# EAGLE design AC-4ch-01 (EAGLE 7.6.0)
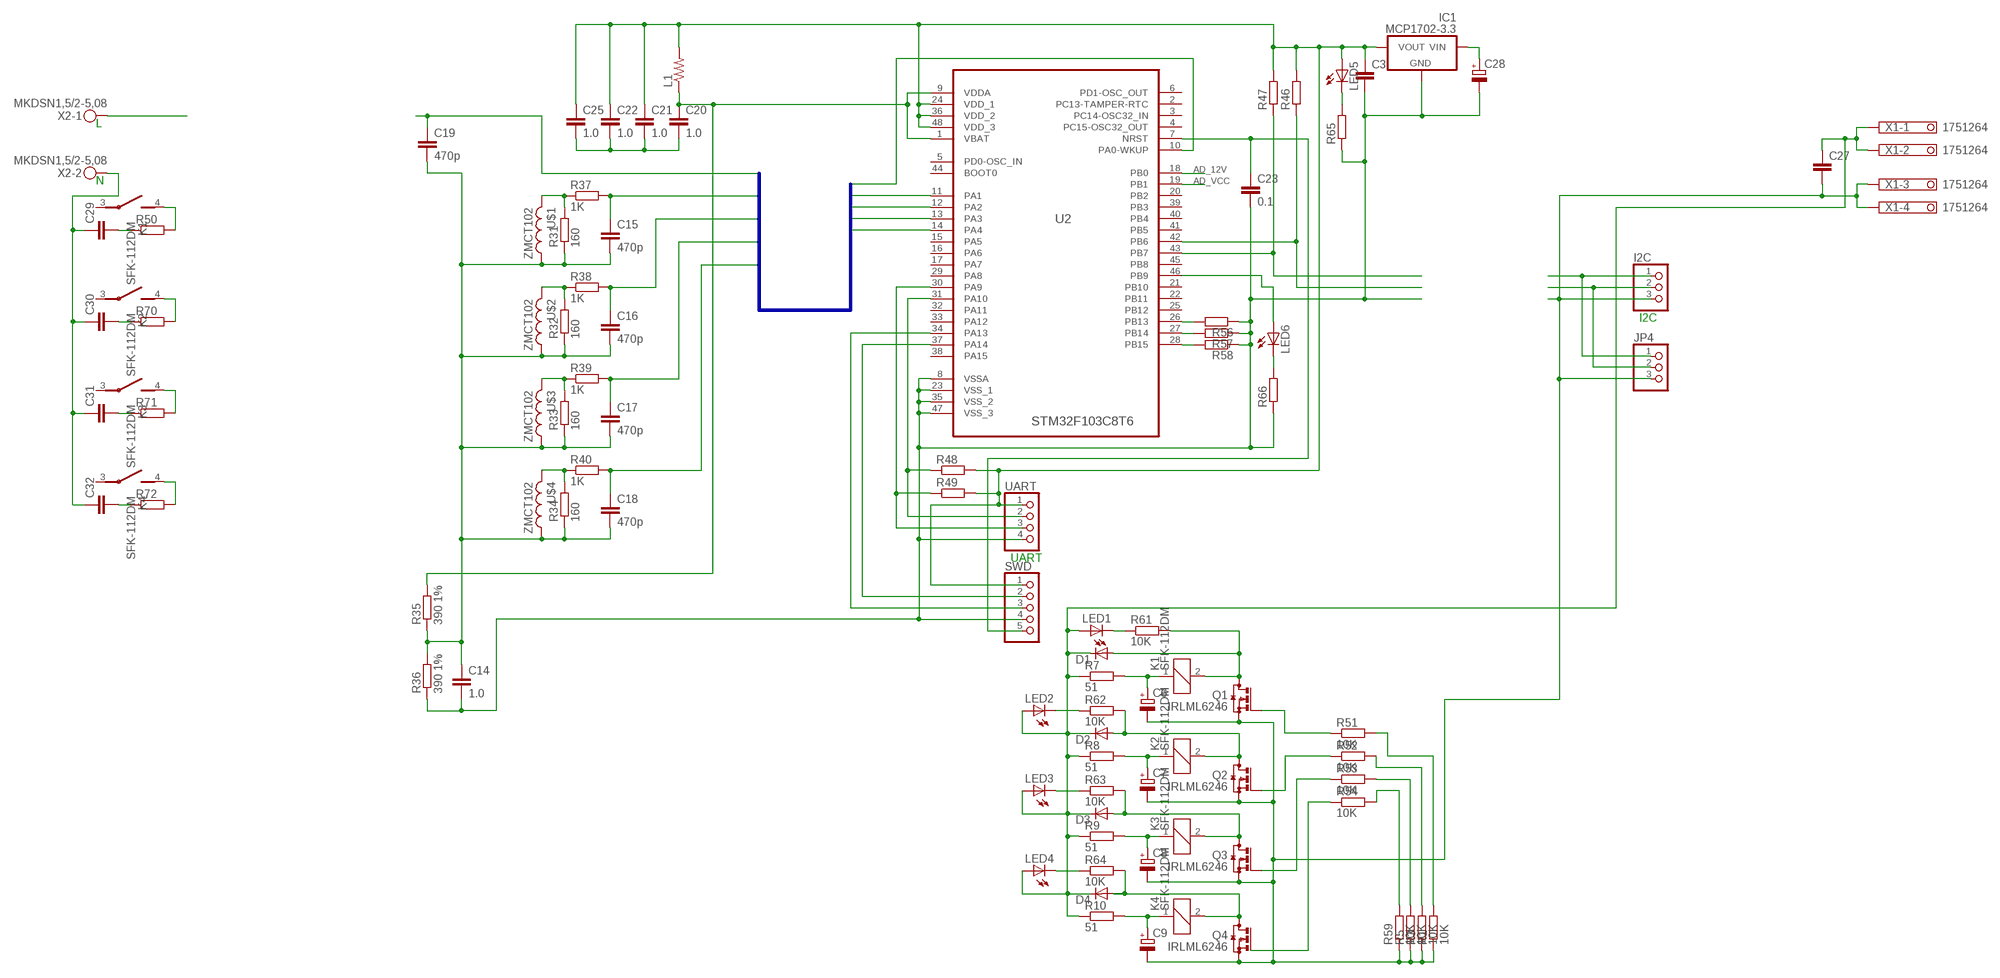
[diagram p0: schematic, sheet 1]

## Parts
C3  C-EUC0805  [C0805]
C6  CPOL-EUE3.5-8  [E3,5-8]
C7  CPOL-EUE3.5-8  [E3,5-8]
C8  CPOL-EUE3.5-8  [E3,5-8]
C9  CPOL-EUE3.5-8  [E3,5-8]
C14  1.0  C-EUC0805  [C0805]
C15  470p  C-EUC0603  [C0603]
C16  470p  C-EUC0603  [C0603]
C17  470p  C-EUC0603  [C0603]
C18  470p  C-EUC0603  [C0603]
C19  470p  C-EUC0603  [C0603]
C20  1.0  C-EUC0805  [C0805]
C21  1.0  C-EUC0805  [C0805]
C22  1.0  C-EUC0805  [C0805]
C23  0.1  C-EUC0603  [C0603]
C25  1.0  C-EUC0805  [C0805]
C27  C-EUC1206  [C1206]
C28  CPOL-EUSMCB  [SMC_B]
C29  C-EU225-087X268  [C225-087X268]
C30  C-EU225-087X268  [C225-087X268]
C31  C-EU225-087X268  [C225-087X268]
C32  C-EU225-087X268  [C225-087X268]
D1  DIODE-SOD123  [SOD123]
D2  DIODE-SOD123  [SOD123]
D3  DIODE-SOD123  [SOD123]
D4  DIODE-SOD123  [SOD123]
I2C  PINHD-1X3  [1X03]
IC1  MCP1702-3.3  MCP1702SOT23  [SOT23-3-ROTATED]
JP4  PINHD-1X3  [1X03]
K1  SFK-112DM  [SFK112]
K2  SFK-112DM  [SFK112]
K3  SFK-112DM  [SFK112]
K4  SFK-112DM  [SFK112]
L1  R-US_M0805  [M0805]
LED1  LEDCHIP-LED0805  [CHIP-LED0805]
LED2  LEDCHIP-LED0805  [CHIP-LED0805]
LED3  LEDCHIP-LED0805  [CHIP-LED0805]
LED4  LEDCHIP-LED0805  [CHIP-LED0805]
LED5  LEDCHIP-LED0805  [CHIP-LED0805]
LED6  LEDCHIP-LED0805  [CHIP-LED0805]
Q1  IRLML6246  BSS123  [SOT23]
Q2  IRLML6246  BSS123  [SOT23]
Q3  IRLML6246  BSS123  [SOT23]
Q4  IRLML6246  BSS123  [SOT23]
R1  10K  R-EU_R0603  [R0603]
R3  10K  R-EU_R0603  [R0603]
R5  10K  R-EU_R0603  [R0603]
R7  51  R-EU_R1206  [R1206]
R8  51  R-EU_R1206  [R1206]
R9  51  R-EU_R1206  [R1206]
R10  51  R-EU_R1206  [R1206]
R31  160  R-EU_R0603  [R0603]
R32  160  R-EU_R0603  [R0603]
R33  160  R-EU_R0603  [R0603]
R34  160  R-EU_R0603  [R0603]
R35  390 1%  R-EU_R0603  [R0603]
R36  390 1%  R-EU_R0603  [R0603]
R37  1K  R-EU_R0603  [R0603]
R38  1K  R-EU_R0603  [R0603]
R39  1K  R-EU_R0603  [R0603]
R40  1K  R-EU_R0603  [R0603]
R46  R-EU_R0603  [R0603]
R47  R-EU_R0603  [R0603]
R48  R-EU_R0603  [R0603]
R49  R-EU_R0603  [R0603]
R50  R-EU_0414/5V  [0414V]
R51  10K  R-EU_R0603  [R0603]
R52  10K  R-EU_R0603  [R0603]
R53  10K  R-EU_R0603  [R0603]
R54  10K  R-EU_R0603  [R0603]
R56  R-EU_R0603  [R0603]
R57  R-EU_R0603  [R0603]
R58  R-EU_R0603  [R0603]
R59  10K  R-EU_R0603  [R0603]
R61  10K  R-EU_R0603  [R0603]
R62  10K  R-EU_R0603  [R0603]
R63  10K  R-EU_R0603  [R0603]
R64  10K  R-EU_R0603  [R0603]
R65  R-EU_R0603  [R0603]
R66  R-EU_R0603  [R0603]
R70  R-EU_0414/5V  [0414V]
R71  R-EU_0414/5V  [0414V]
R72  R-EU_0414/5V  [0414V]
SWD  PINHD-1X5  [1X05]
U2  STM32F103C8T6  STM32F100CBT6B  [QFP50P900X900X160-48N]
U$1  ZMCT102  [ZMCT]
U$2  ZMCT102  [ZMCT]
U$3  ZMCT102  [ZMCT]
U$4  ZMCT102  [ZMCT]
UART  PINHD-1X4  [1X04]
X1  1751264  [1751264]
X2  MKDSN1,5/2-5,08  [MKDSN1,5/2-5,08]

## Nets
0V: C3.2 C14.2 C20.2 C21.2 C22.2 C23.2 C25.2 C28.- IC1.1(GND) R36.1 R56.1 R57.1 R58.1 R65.1 R66.1 SWD.4 U2.8(VSSA) U2.23(VSS_1) U2.35(VSS_2) U2.47(VSS_3) UART.4
3.3V: C3.1 C21.1 C22.1 C25.1 IC1.2(VOUT) L1.2 LED5.A R46.2 R47.2 R48.2 R49.2 SWD.1 U2.24(VDD_1) U2.36(VDD_2) U2.48(VDD_3) UART.1
+12V: C27.1 D1.C D2.C D3.C D4.C LED1.A LED2.A LED3.A LED4.A R7.1 R8.1 R9.1 R10.1 X1.1 X1.2
A0: C18.1 R40.2 U2.10(PA0-WKUP)
A1: C17.1 R39.2 U2.11(PA1)
A2: C16.1 R38.2 U2.12(PA2)
A3: C15.1 R37.2 U2.13(PA3)
A4: C19.1 U2.14(PA4)
A9: C14.1 C15.2 C16.2 C17.2 C18.2 C19.2 R31.1 R32.1 R33.1 R34.1 R35.1 R36.2 U$1.1 U$2.1 U$3.1 U$4.1
AD_12V: U2.18(PB0)
AD_VCC: U2.19(PB1)
GND: C6.- C7.- C8.- C9.- C27.2 I2C.3 JP4.3 Q1.2(S) Q2.2(S) Q3.2(S) Q4.2(S) R1.1 R3.1 R5.1 R59.1 X1.3 X1.4
I2C: I2C.2 JP4.2
N$1: C29.1 C30.1 C31.1 C32.1 X2.2
N$2: C29.2 R50.1
N$4: R31.2 R37.1 U$1.2
N$5: R32.2 R38.1 U$2.2
N$6: R56.2 U2.26(PB13)
N$7: C30.2 R70.1
N$8: C31.2 R71.1
N$12: LED1.C R61.1
N$13: R47.1 U2.43(PB7)
N$14: R33.2 R39.1 U$3.2
N$15: R46.1 U2.42(PB6)
N$16: R34.2 R40.1 U$4.2
N$17: LED2.C R62.1
N$18: C32.2 R72.1
N$19: LED3.C R63.1
N$20: LED4.C R64.1
N$21: LED5.C R65.2
N$22: LED6.C R66.2
N$23: LED6.A U2.46(PB9)
N$26: R57.2 U2.27(PB14)
N$28: R5.2 R53.2
N$31: C23.1 SWD.5 U2.7(NRST)
N$32: R3.2 R52.2
N$33: R1.2 R51.2
N$34: R54.2 R59.2
N$36: R58.2 U2.28(PB15)
N$37: X2.1
N$38: Q1.1(G) R51.1
N$39: Q2.1(G) R52.1
N$40: Q3.1(G) R53.1
N$41: Q4.1(G) R54.1
N$42: C28.+ IC1.3(VIN)
N$44: D2.A K2.2 Q2.3(D) R62.2
N$45: C7.+ K2.1 R8.2
N$46: C8.+ K3.1 R9.2
N$47: D3.A K3.2 Q3.3(D) R63.2
N$48: C9.+ K4.1 R10.2
N$49: D4.A K4.2 Q4.3(D) R64.2
N$50: D1.A K1.2 Q1.3(D) R61.2
N$51: C6.+ K1.1 R7.2
N$74: K1.4(K:S) R50.2
N$75: K2.4(K:S) R70.2
N$76: K3.4(K:S) R71.2
N$77: K4.4(K:S) R72.2
N$80: C20.1 L1.1 R35.2 U2.1(VBAT) U2.9(VDDA)
RX: R48.1 U2.31(PA10) UART.2
SDA: I2C.1 JP4.1
SWCLK: SWD.2 U2.37(PA14)
SWDIO: SWD.3 U2.34(PA13)
TX: R49.1 U2.30(PA9) UART.3
Unconnected: K1.3(K:P) K2.3(K:P) K3.3(K:P) K4.3(K:P) U2.2(PC13-TAMPER-RTC) U2.3(PC14-OSC32_IN) U2.4(PC15-OSC32_OUT) U2.5(PD0-OSC_IN) U2.6(PD1-OSC_OUT) U2.15(PA5) U2.16(PA6) U2.17(PA7) U2.20(PB2) U2.21(PB10) U2.22(PB11) U2.25(PB12) U2.29(PA8) U2.32(PA11) U2.33(PA12) U2.38(PA15) U2.39(PB3) U2.40(PB4) U2.41(PB5) U2.44(BOOT0) U2.45(PB8)

## Buses
B$1

## Notes on the sheet
- L
- N
- I2C
- UART

## Library data of the parts
C3 C14-C23 C25 C27 C29-C32 = rcl:C-EU: CAPACITOR, European symbol
C6-C9 C28 = rcl:CPOL-EU: POLARIZED CAPACITOR, European symbol
D1-D4 = diode:DIODE-: DIODE
I2C JP4 = pinhead:PINHD-1X3: PIN HEADER
IC1 = SteveMarple:MCP1702: Microchip MCP1702 250mA low quiescent current (2uA) LDO voltage regulator.
K1-K4 = custom:SFK-112DM
L1 = rcl:R-US_: RESISTOR, American symbol
LED1-LED6 = led:LED: LED OSRAM: - CHIPLED LG R971, LG N971, LY N971, LG Q971, LY Q971, LO R971, LY R971 LH N974, LH R974 LS Q976, LO Q976, LY Q976 LO Q996 - Hyper CHIPLED LW Q18S LB Q993, LB Q99A, LB R99A - SideLED LS A670, LO A670, LY A670, LG A670, LP A670 LB A673, LV A673, LT A673, LW A673 LH A674 LY A675 LS A676, LA A676, LO A676, LY A676, LW A676 LS A679, LY A679, LG A679 - Hyper Micro SIDELED® LS Y876, LA Y876, LO Y876, LY Y876 LT Y87S - SmartLED LW L88C, LW L88S LB L89C, LB L89S, LG L890 LS L89K, LO L89K, LY L89K LS L896, LA L896, LO L896, LY L896 - TOPLED LS T670, LO T670, LY T670, LG T670, LP T670 LSG T670, LSP T670, LSY T670, LOP T670, LYG T670 LG T671, LOG T671, LSG T671 LB T673, LV T673, LT T673, LW T673 LH T674 LS T676, LA T676, LO T676, LY T676, LB T676, LH T676, LSB T676, LW T676 LB T67C, LV T67C, LT T67C, LS T67K, LO T67K, LY T67K, LW E67C LS E67B, LA E67B, LO E67B, LY E67B, LB E67C, LV E67C, LT E67C LW T67C LS T679, LY T679, LG T679 LS T770, LO T770, LY T770, LG T770, LP T770 LB T773, LV T773, LT T773, LW T773 LH T774 LS E675, LA E675, LY E675, LS T675 LS T776, LA T776, LO T776, LY T776, LB T776 LHGB T686 LT T68C, LB T68C - Hyper Mini TOPLED® LB M676 - Mini TOPLED Santana® LG M470 LS M47K, LO M47K, LY M47K Source: http://www.osram.convergy.de LUXEON: - LUMILED® LXK2-PW12-R00, LXK2-PW12-S00, LXK2-PW14-U00, LXK2-PW14-V00 LXK2-PM12-R00, LXK2-PM12-S00, LXK2-PM14-U00 LXK2-PE12-Q00, LXK2-PE12-R00, LXK2-PE12-S00, LXK2-PE14-T00, LXK2-PE14-U00 LXK2-PB12-K00, LXK2-PB12-L00, LXK2-PB12-M00, LXK2-PB14-N00, LXK2-PB14-P00, LXK2-PB14-Q00 LXK2-PR12-L00, LXK2-PR12-M00, LXK2-PR14-Q00, LXK2-PR14-R00 LXK2-PD12-Q00, LXK2-PD12-R00, LXK2-PD12-S00 LXK2-PH12-R00, LXK2-PH12-S00 LXK2-PL12-P00, LXK2-PL12-Q00, LXK2-PL12-R00 Source: www.luxeon.com KINGBRIGHT: KA-3528ASYC Source: www.kingbright.com
Q1-Q4 = transistor-small-signal:BSS123: N-CHANNEL MOS FET
R1 R3 R5 R7-R10 R31-R40 R46-R54 R56-R59 R61-R66 R70-R72 = rcl:R-EU_: RESISTOR, European symbol
SWD = pinhead:PINHD-1X5: PIN HEADER
U2 = ST Microelctronics_By_element14_Batch_1:STM32F100CBT6B: ARM-based 32-bit MCU; MPN: STM32F100CBT6B; OC_FARNELL: 1838512; OC_NEWARK: 86R1308; PACKAGE: LQFP-48; SUPPLIER: STMircroelectronics
U$1-U$4 = custom:ZMCT102
UART = pinhead:PINHD-1X4: PIN HEADER
X1 = con-phoenix-350:1751264: MKDS 1/ 4-3,5 Printklemme Nennstrom: 10 A Bemessungsspannung: 160 V Raster: 3,5 mm Polzahl: 4 Montageart: Löten Anschlussart: Schraubanschluss Anschlussrichtung vom Leiter zur Platine: 0° Source: http://eshop.phoenixcontact.com .. 1751264.pdf; MPN: 1751264; OC_FARNELL: unknown; OC_NEWARK: 10R0934
X2 = con-phoenix-508:MKDSN1,5/2-5,08: MKDSN 1,5/ 2-5,08 Printklemme Nennstrom: 13,5 A Nennspannung: 250 V Rastermaß: 5,08 mm Polzahl: 2 Anschlussart: Schraubanschluss Montage: Löten Anschlussrichtung Leiter/Platine: 0 ° Artikelnummer: 1729128 Source: http://eshop.phoenixcontact.com .. 1729128.pdf

## Board
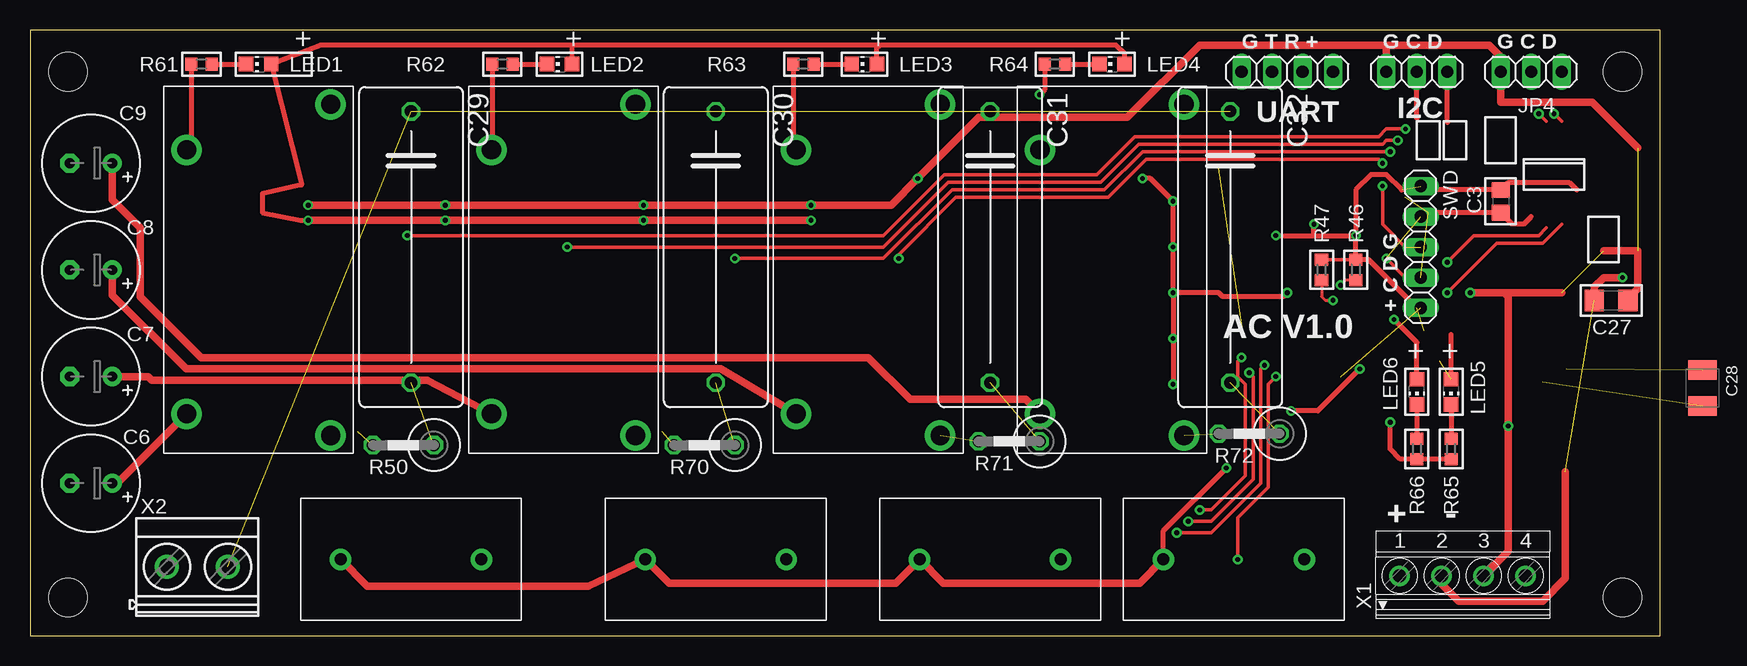
[diagram p1: board, top side]
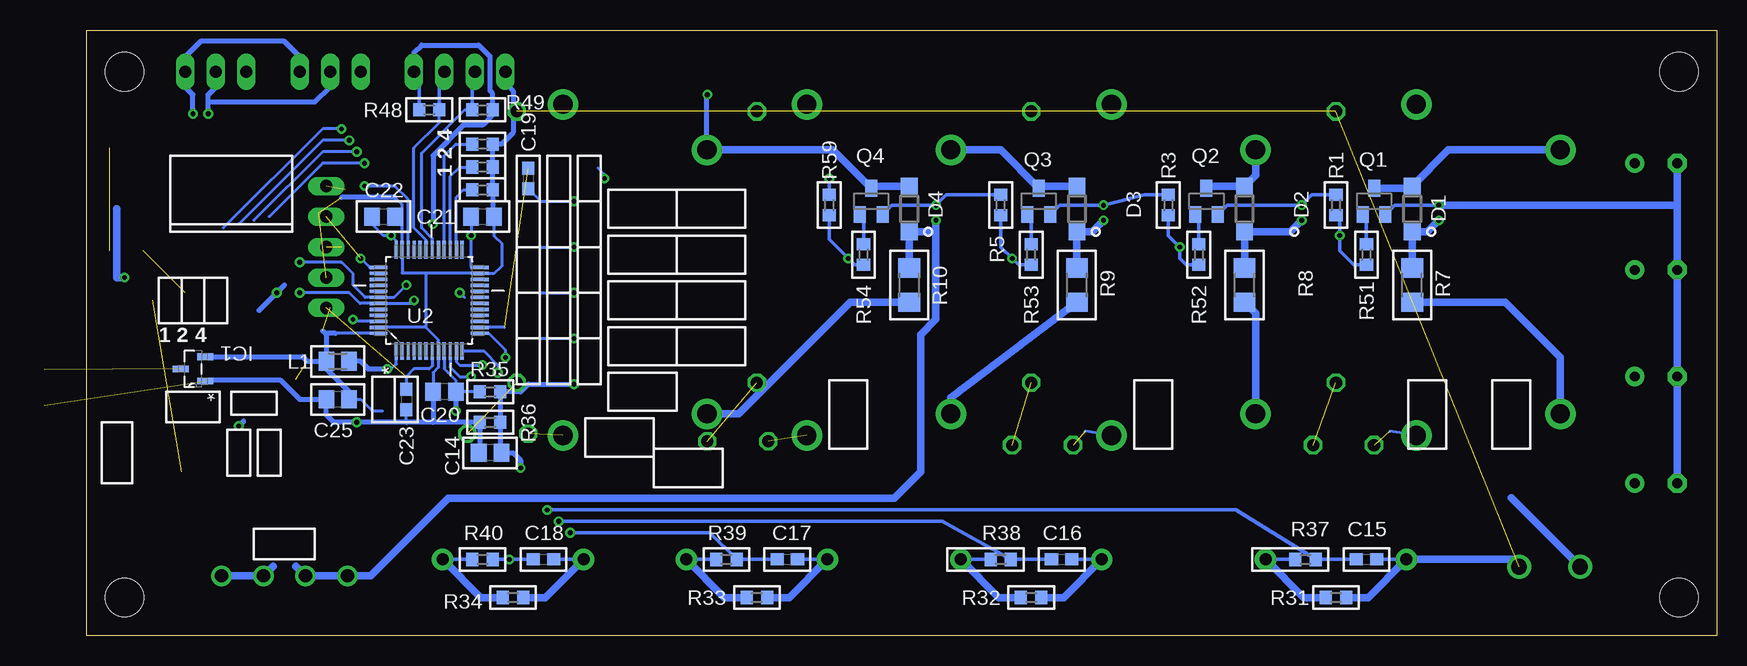
[diagram p2: board, bottom side, seen from below]

Size 135.87 x 50.47 mm. Coordinates in mm from the lower left corner, seen from the top.
Outline: 0,0 135.87,0 135.87,50.47 0,50.47 0,0
Copper layers (1*16): Top 0.035mm / dielectric 1.5mm / Bottom 0.035mm
Design rules "default *": minimum track width 8mil, minimum drill 0.35mm, track to track 6mil, track to pad 8mil, pad to pad 10mil, via to via 10mil, smd to smd 8mil, copper to edge 30mil, drill to drill 20mil, minimum pad ring 10mil, minimum via ring 8mil, stop-mask expansion 4mil, vias tented up to drill 20mil, thermal gap 10mil
Holes 3.2 mm at 132.72,46.99 3.17,46.99 3.17,3.17 132.72,3.17

### Footprints (pad centres in the part's own frame; a part is rotated, then mirrored left to right if it is on the bottom)
C0805 = smd 1.3 x 1.5: 1 -0.95,0; 2 0.95,0
E3,5-8 = drill 0.813 pad 1.6: + -1.778,0 | drill 0.813 pad 1.6 octagon: - 1.778,0
C0603 = smd 1.1 x 1: 1 -0.85,0; 2 0.85,0
C1206 = smd 1.6 x 1.8: 1 -1.4,0; 2 1.4,0
SMC_B = smd 1.6 x 2.4: + -1.5,0; - 1.5,0
C225-087X268 = drill 1.016 octagon: 1 -11.303,0; 2 11.303,0
SOD123 = smd 1.4 x 1.4: A 1.9,0; C -1.9,0
1X03 = drill 1.016 long: 1 -2.54,0; 2 0,0; 3 2.54,0
SOT23-3-ROTATED = smd 1.321 x 0.559: 1 -1.016,1.016; 2 -1.016,-1.016; 3 1.016,0
SFK112 = drill 1.6 pad 2.54: 1 -12,6; 2 10,6; 3 13.8,-6; 4 -13.8,-6
M0805 = smd 1.3 x 1.6: 1 -0.95,0; 2 0.95,0
CHIP-LED0805 = smd 1.2 x 1.2: A 0,-1.05; C 0,1.05
SOT23 = smd 1 x 1.4: 1 -0.95,-1.1; 2 0.95,-1.1; 3 0,1.1
R0603 = smd 1 x 1.1: 1 -0.85,0; 2 0.85,0
R1206 = smd 1.6 x 1.803: 1 -1.422,0; 2 1.422,0
0414V = drill 1.016 octagon: 1 -2.54,0; 2 2.54,0
1X05 = drill 1.016 long: 1 -5.08,0; 2 -2.54,0; 3 0,0; 4 2.54,0; 5 5.08,0
QFP50P900X900X160-48N = smd 1.473 x 0.279: 1 -4.216,2.743; 2 -4.216,2.261; 3 -4.216,1.753; 4 -4.216,1.245; 5 -4.216,0.762; 6 -4.216,0.254; 7 -4.216,-0.254; 8 -4.216,-0.762; 9 -4.216,-1.245; 10 -4.216,-1.753; 11 -4.216,-2.261; 12 -4.216,-2.743; 25 4.216,-2.743; 26 4.216,-2.261; 27 4.216,-1.753; 28 4.216,-1.245; 29 4.216,-0.762; 30 4.216,-0.254; 31 4.216,0.254; 32 4.216,0.762; 33 4.216,1.245; 34 4.216,1.753; 35 4.216,2.261; 36 4.216,2.743 | smd 0.279 x 1.473: 13 -2.743,-4.216; 14 -2.261,-4.216; 15 -1.753,-4.216; 16 -1.245,-4.216; 17 -0.762,-4.216; 18 -0.254,-4.216; 19 0.254,-4.216; 20 0.762,-4.216; 21 1.245,-4.216; 22 1.753,-4.216; 23 2.261,-4.216; 24 2.743,-4.216; 37 2.743,4.216; 38 2.261,4.216; 39 1.753,4.216; 40 1.245,4.216; 41 0.762,4.216; 42 0.254,4.216; 43 -0.254,4.216; 44 -0.762,4.216; 45 -1.245,4.216; 46 -1.753,4.216; 47 -2.261,4.216; 48 -2.743,4.216
ZMCT = drill 1 pad 1.778: 1 -5.874,0; 2 5.874,0
1X04 = drill 1.016 long: 1 -3.81,0; 2 -1.27,0; 3 1.27,0; 4 3.81,0
1751264 = drill 1.1 pad 1.7: 1 -5.25,-0.1; 2 -1.75,-0.1; 3 1.75,-0.1; 4 5.25,-0.1
MKDSN1,5/2-5,08 = drill 1.3 pad 2: 1 -2.561,0.025; 2 2.519,0.025

### Placement (x,y rotation side)
C3  122.55,36.2 270 top
C6  5.08,12.7 180 top
C7  5.08,21.59 180 top
C8  5.08,30.48 180 top
C9  5.08,39.37 180 top
C14  102.23,15.24 180 bottom
C15  29.21,6.35 0 bottom
C16  54.61,6.35 0 bottom
C17  77.47,6.35 0 bottom
C18  97.79,6.35 0 bottom
C19  99.06,38.1 270 bottom
C20  106.05,20.32 180 bottom
C21  102.87,34.92 0 bottom
C22  111.12,34.92 0 bottom
C23  109.22,19.68 270 bottom
C25  114.94,19.68 180 bottom
C27  131.76,27.94 0 top
C28  139.38,20.64 270 top  (outside the outline)
C29  31.75,32.38 270 top
C30  57.15,32.38 270 top
C31  80.01,32.38 270 top
C32  100.01,32.38 270 top
D1  25.4,35.56 90 bottom
D2  39.37,35.56 90 bottom
D3  53.34,35.56 90 bottom
D4  67.31,35.56 90 bottom
I2C  115.57,46.99 180 top
IC1  127,22.23 180 bottom
JP4  125.09,46.99 180 top
K1  19.05,30.48 90 top
K2  44.45,30.48 90 top
K3  69.85,30.48 90 top
K4  90.17,30.48 90 top
L1  114.94,22.86 180 bottom
LED1  19.05,47.62 90 top
LED2  44.13,47.62 90 top
LED3  69.53,47.62 90 top
LED4  90.17,47.62 90 top
LED5  118.43,20.32 180 top
LED6  115.57,20.32 180 top
Q1  28.57,36.2 0 bottom
Q2  42.55,36.2 0 bottom
Q3  56.52,36.2 0 bottom
Q4  70.48,36.2 0 bottom
R1  31.75,35.88 270 bottom
R3  45.72,35.88 270 bottom
R5  59.69,35.88 270 bottom
R7  25.4,29.21 270 bottom
R8  39.37,29.21 270 bottom
R9  53.34,29.21 270 bottom
R10  67.31,29.21 270 bottom
R31  31.75,3.17 180 bottom
R32  57.15,3.17 180 bottom
R33  80.01,3.17 180 bottom
R34  100.33,3.17 180 bottom
R35  102.23,20.32 180 bottom
R36  102.23,17.78 0 bottom
R37  34.29,6.35 0 bottom
R38  59.69,6.35 0 bottom
R39  82.55,6.35 0 bottom
R40  102.87,6.35 0 bottom
R46  110.49,30.48 90 top
R47  107.63,30.48 90 top
R48  107.31,43.81 180 bottom
R49  102.87,43.81 0 bottom
R50  31.11,15.88 180 top
R51  29.21,31.75 270 bottom
R52  43.18,31.75 270 bottom
R53  57.15,31.75 270 bottom
R54  71.12,31.75 270 bottom
R56  102.87,37.15 180 bottom
R57  102.87,39.05 180 bottom
R58  102.87,40.96 180 bottom
R59  73.98,35.88 270 bottom
R61  14.29,47.62 180 top
R62  39.37,47.62 180 top
R63  64.45,47.62 180 top
R64  85.41,47.62 180 top
R65  118.43,15.56 90 top
R66  115.57,15.56 90 top
R70  56.2,15.88 180 top
R71  81.6,16.19 180 top
R72  101.6,16.83 180 top
SWD  115.89,32.38 270 top
U2  107.31,27.94 90 bottom
U$1  31.75,6.35 0 top
U$2  57.15,6.35 0 top
U$3  80.01,6.35 0 top
U$4  100.33,6.35 0 top
UART  104.77,46.99 180 top
X1  119.38,5.08 0 top
X2  13.97,5.71 0 top

### Tracks (layer width: path | path; a pad name or v marks a point on that pad's centre or on a via)
0V  (via drill 0.4)  (3 unrouted)
  Top 0.406: 116.52,35.24 C3.2 123.51,34.29 124.46,34.29 125.09,34.92 | R65.1 R66.1 114.2,14.71 113.35,15.56 v113.35,17.78
  Bottom 0.254: 107.59,25.68 106.55,24.64 U2.8 106.55,22.35 106.99,21.91 C20.2 | 107.59,25.68 U2.47 | 103.08,15.34 C14.2 | 109.22,17.78 C23.2 | 106.99,17.78 107,17.78 | 102.02,35.02 C21.2 101.92,33.34 101.28,32.7 101.28,30.8 101.88,30.2 U2.23 107.63,30.2 | 109.58,34.89 U2.35 109.58,30.2 107.63,30.2 | 109.58,34.89 C22.2 | 107.59,25.68 107.59,30.16 107.63,30.2 | 109.58,34.89 109.58,35.92 110.17,36.51 | 125.92,21.27 IC1.1
  Bottom 0.305: IC1.1 126.05,21.14
  Bottom 0.406: 103.08,15.34 R36.1 107,17.78 109.22,17.78 v113.35,17.78 115.25,17.78 115.89,18.41 C25.2 arc90 C25.2 118.11,19.68 119.7,21.27 125.92,21.27 | C20.2 106.99,17.78 | 102.02,35.02 R56.1 R57.1 R58.1 101.28,40.96 100.33,41.91 100.33,45.4 100.97,46.04 UART.4 | 110.17,36.51 114.62,36.51
3.3V  (via drill 0.4)  (3 unrouted)
  Top 0.305: R47.2 R46.2
  Top 0.406: v103.82,33.34 107,33.34 | 107,33.34 v110.49,33.34 | 107,33.34 v107,34.29 | v110.49,33.34 R46.2 111.55,31.33 115.57,27.3 | v110.49,33.34 110.49,37.15 111.76,38.42 113.03,38.42 114.3,37.15 C3.1 123.19,37.78 128.27,37.78 128.91,37.15 | LED5.A 118.43,25.08
  Bottom 0.254: U2.48 115.14,25.2 | 111.23,18.73 112.08,18.73 113.03,19.68 C25.1 113.98,20.32 | L1.2 115.88,22.22 | 108.16,46.57 UART.1 | U2.36 110.06,32.91 v110.49,33.34 111.12,33.34 112.08,34.29 C22.1 | U2.24 103.82,30.68 103.82,30.8 v103.82,33.34 | C21.1 v103.82,33.34 | v103.82,33.34
  Bottom 0.305: R48.2 108.16,46.57
  Bottom 0.406: 115.88,25.08 L1.2 117.47,22.86 117.86,23.24 IC1.2 | 115.88,22.22 113.98,20.32 | UART.1 108.58,48.58 107.95,49.21 103.19,49.21 102.23,48.26 102.23,45.4 102.02,45.19 R49.2 102.02,43.4 102.87,42.55 104.46,42.55 107,40.01 v107,34.29 | 116.2,25.4 115.88,25.08 | 115.14,25.2 115.77,25.2 arc-90 115.88,25.08
+12V  (via drill 0.4)  (1 unrouted)
  Top 0.254: 117.63,4.29 X1.2
  Top 0.406: LED4.A 91.22,48.48 90.49,49.21 70.8,49.21 | 70.8,49.21 45.08,49.21 | 45.08,49.21 24.23,49.21 LED1.A 22.64,37.56 19.37,36.83 19.37,35.24 22.54,34.61 v23.18,34.61 | LED2.A 45.18,49.12 45.08,49.21 | LED3.A 70.58,48.99 70.8,49.21
  Top 0.61: v65.09,34.61 v51.12,34.61 v34.61,34.61 v23.18,34.61 | 127.95,13.65 127.95,4.76 126.05,2.86 119.06,2.86 117.63,4.29 | v132.72,29.84 131.13,29.84 130.36,29.08 C27.1
  Bottom 0.254: D2.C
  Bottom 0.61: 133.35,35.56 133.35,29.84 v132.72,29.84 | 118.43,5.78 X1.2 X1.1 112.18,4.98 105.73,11.43 68.58,11.43 66.36,13.65 66.36,25.08 65.09,26.35 65.09,33.66 | R7.1 D1.C 24.12,33.66 v23.18,34.61 | R8.1 D2.C 35.55,33.66 v34.61,34.61 | R9.1 D3.C 52.06,33.66 v51.12,34.61 | R10.1 D4.C 65.09,33.66 arc90 65.09,33.66 | 65.09,33.66 v65.09,34.61
A0  (via drill 0.4)
  Top 0.305: v100.65,6.35 100.65,9.84 103.19,12.38 103.19,20.95 v103.82,21.59
  Bottom 0.254: U2.10 105.56,22.38 104.77,21.59 v103.82,21.59
  Bottom 0.305: R40.2 v100.65,6.35 C18.1
A1  (via drill 0.4)
  Top 0.305: v102.87,22.54 102.55,22.23 102.55,12.7 98.42,8.57 v95.57,8.57
  Bottom 0.254: U2.11 105.05,22.82 104.77,22.54 v102.87,22.54
  Bottom 0.305: C17.1 R39.2 83.92,8.57 v95.57,8.57
A2  (via drill 0.4)
  Top 0.305: v101.6,21.91 101.92,21.59 101.92,13.02 98.42,9.53 v96.52,9.53
  Bottom 0.254: U2.12 102.78,23.72 101.6,22.54 v101.6,21.91
  Bottom 0.305: C16.1 R38.2 64.56,9.53 v96.52,9.53
A3  (via drill 0.4)
  Top 0.305: v100.97,23.18 100.65,22.86 100.65,21.59 101.28,20.95 101.28,13.34 98.42,10.48 v97.47,10.48
  Bottom 0.254: U2.13 102.35,25.2 100.97,23.81 v100.97,23.18
  Bottom 0.305: C15.1 R37.2 40.11,10.48 v97.47,10.48
A4  (1 unrouted)
  Bottom 0.254: 101.03,25.68 U2.14
A9  (via drill 0.4)
  Top 0.406: U$4.1 94.46,8.73 v99.69,13.97 | v95.25,20.95 v95.25,24.77 v95.25,28.57 | v95.25,28.57 v95.25,32.38 v95.25,36.2 93.34,38.1 v92.71,38.1 | v104.77,28.57 104.46,28.26 99.38,28.26 99.06,28.57 v95.25,28.57
  Top 0.61: U$1.1 28.1,4.13 46.51,4.13 U$2.1 53.26,4.37 72.15,4.37 U$3.1 76.12,4.37 92.47,4.37 U$4.1
  Bottom 0.254: 101.38,15.34 C14.1 | C19.2 98,36.2 v95.25,36.2 95.03,36.2 | 98,32.38 v95.25,32.38 95.03,32.38 | 98,28.57 v95.25,28.57 95.03,28.57 | 98,24.77 v95.25,24.77 95.03,24.77 | 104.39,28.19 v104.77,28.57 | 93.24,38.95 92.71,38.42 v92.71,38.1
  Bottom 0.305: U$4.1 C18.2 | U$3.1 C17.2 | U$2.1 C16.2 | C15.2 U$1.1
  Bottom 0.406: 101.38,15.34 R36.2 R35.1 99.69,20.32 99.06,20.95 v95.25,20.95 | C14.1 100.33,15.24 99.69,14.61 v99.69,13.97
  Bottom 0.61: R34.1 97.63,3.17 U$4.1 | R33.1 77.31,3.17 U$3.1 | R32.1 54.45,3.17 U$2.1 | R31.1 29.05,3.17 U$1.1 17.1,6.35
GND  (via drill 0.4)  (2 unrouted)
  Top 0.61: 133.99,40.64 130.18,44.45 122.55,44.45 JP4.3 122.55,48.26 121.6,49.21 113.03,49.21 | v23.18,35.88 v34.61,35.88 v51.12,35.88 v65.09,35.88 71.75,35.88 v73.98,38.1 79.06,43.18 91.44,43.18 97.47,49.21 113.03,49.21 | 127.63,28.57 122.87,28.57 | 122.87,28.57 v120.02,28.57 | 131.13,32.07 133.99,32.07 133.99,28.89 133.03,27.94 C27.2 | 122.87,28.57 123.19,28.26 v123.19,17.46 123.19,7.04 X1.3 | I2C.3 113.03,49.21
  Bottom 0.305: Q1.2 26.84,35.88 v23.18,35.88 | Q2.2 40.81,35.88 v34.61,35.88 33.76,36.73 R1.1 | Q3.2 54.78,35.88 v51.12,35.88 47.73,36.73 R3.1 | Q4.2 68.75,35.88 v65.09,35.88 64.24,36.73 R5.1 | R59.1 v73.98,38.1
  Bottom 0.406: 121.5,27.09 v120.02,28.57 119.38,29.21 | 122.77,17.88 v123.19,17.46
  Bottom 0.61: 120.33,5.78 X1.3 X1.4 | C6.- C7.- C8.- 3.3,35.88 | 3.3,35.88 C9.- | v23.18,35.88 3.3,35.88
I2C  (via drill 0.4)
  Top 0.305: 126.36,42.86 v125.73,43.5
  Top 0.406: 115.57,43.08 I2C.2
  Bottom 0.406: v125.73,43.5 125.73,44.45 | 125.73,44.45 125.73,45.09 125.09,45.72 JP4.2 | I2C.2 115.57,45.72 116.84,44.45 125.73,44.45
N$1  (4 unrouted)
N$2  (1 unrouted)
N$4
  Bottom 0.305: U$1.2 R37.1
  Bottom 0.61: R31.2 34.45,3.17 U$1.2
N$5
  Bottom 0.305: U$2.2 R38.1
  Bottom 0.61: R32.2 59.85,3.17 U$2.2
N$6
  Bottom 0.254: U2.26 105.05,36.55 104.46,37.15 R56.2
N$7  (1 unrouted)
N$8  (1 unrouted)
N$12
  Top 0.406: R61.1 LED1.C
N$13  (via drill 0.4)
  Top 0.254: R47.1 107.63,28.26 107.95,27.94 v108.58,27.94
  Top 0.305: v118.11,28.57 122.24,32.7 126.05,32.7 127.63,34.29
  Bottom 0.254: v118.11,28.57 113.98,28.57 113.09,27.69 U2.43 108.84,27.69 v108.58,27.94
N$14
  Bottom 0.305: U$3.2 R39.1
  Bottom 0.61: R33.2 82.71,3.17 U$3.2
N$15  (via drill 0.4)
  Top 0.254: R46.1 109.64,29.63 v109.22,29.21
  Top 0.305: v118.11,31.11 120.33,33.34 125.73,33.34 126.36,33.97
  Bottom 0.254: v118.11,31.11 114.62,31.11 113.66,30.16 113.66,29.21 112.65,28.19 U2.42 110.24,28.19 v109.22,29.21
N$16
  Bottom 0.305: U$4.2 R40.1
  Bottom 0.61: R34.2 103.03,3.17 U$4.2
N$17
  Top 0.406: R62.1 LED2.C
N$18  (1 unrouted)
N$19
  Top 0.406: R63.1 LED3.C
N$20
  Top 0.406: R64.1 LED4.C
N$21
  Top 0.406: LED5.C R65.2
N$22
  Top 0.406: LED6.C R66.2
N$23  (via drill 0.4)
  Top 0.406: LED6.A 115.57,24.45 v113.66,26.35
  Bottom 0.254: U2.46 113.5,26.19 v113.66,26.35
N$26
  Bottom 0.254: U2.27 105.56,38.27 104.77,39.05 R57.2
N$28  (via drill 0.4)
  Top 0.305: v58.74,31.43 71.12,31.43 76.83,37.15 89.53,37.15 92.71,40.32 v113.35,40.32
  Bottom 0.254: v113.35,40.32 116.2,40.32 121.92,34.61
  Bottom 0.305: R53.2 58.2,30.9 v58.74,31.43 59.69,32.38 R5.2
N$31  (1 unrouted)
  Bottom 0.254: U2.7 107.06,22.48 107.31,22.23 108.58,22.23 109.22,21.59 C23.1
N$32  (via drill 0.4)
  Top 0.305: v44.77,32.38 71.12,32.38 76.52,37.78 89.22,37.78 92.39,40.96 112.71,40.96 113.03,41.27 v113.98,41.27
  Bottom 0.254: v113.98,41.27 116.2,41.27 123.19,34.29
  Bottom 0.305: R52.2 44.23,30.9 44.77,31.43 v44.77,32.38 45.72,33.34 R3.2
N$33  (via drill 0.4)
  Top 0.305: v31.43,33.34 71.12,33.34 76.2,38.42 88.9,38.42 92.08,41.59 112.39,41.59 113.03,42.23 v114.62,42.23
  Bottom 0.254: 124.46,33.97 116.2,42.23 v114.62,42.23 | R1.2 31.43,34.71
  Bottom 0.305: R51.2 30.27,30.9 31.43,32.07 v31.43,33.34 31.43,34.71
N$34  (via drill 0.4)
  Top 0.254: v72.39,31.43 72.39,31.75
  Top 0.305: 72.39,31.75 77.15,36.51 89.85,36.51 93.03,39.69 112.39,39.69 v112.71,39.37
  Bottom 0.254: v112.71,39.37 116.2,39.37 120.65,34.92
  Bottom 0.305: R54.2 71.86,30.9 v72.39,31.43 73.98,33.02 R59.2
N$36
  Bottom 0.254: U2.28 106.07,39.98 105.09,40.96 R58.2
N$37
  Bottom 0.61: 17.14,11.48 X2.1
N$38
  Bottom 0.254: 29.21,34.78 Q1.1
  Bottom 0.305: R51.1 29.21,34.78
N$39
  Bottom 0.254: Q2.1 43.18,34.78
  Bottom 0.305: 43.18,34.78 R52.1
N$40
  Bottom 0.254: Q3.1 57.15,34.78
  Bottom 0.305: 57.15,34.78 R53.1
N$41
  Bottom 0.254: Q4.1 71.12,34.78
  Bottom 0.305: 71.12,34.78 R54.1
N$42  (1 unrouted)
N$44
  Top 0.406: R62.2 38.52,40.55 K2.2
  Bottom 0.254: Q2.3 42.38,37.46
  Bottom 0.61: K2.2 38.45,38.38 D2.A 42.38,37.46
N$45
  Top 0.61: K2.1 33.12,21.27 10.16,21.27 9.84,21.59 C7.+
  Bottom 0.61: R8.2 38.45,26.87 K2.1
N$46
  Top 0.61: C8.+ 6.86,28.38 13.02,22.23 57.56,22.23 K3.1
  Bottom 0.61: K3.1 63.85,19.82 R9.2
N$47
  Top 0.406: R63.2 63.6,40.73 K3.2
  Bottom 0.254: Q3.3 56.35,37.46
  Bottom 0.61: K3.2 59.7,40.48 Q3.3 | 56.35,37.46 D3.A
N$48
  Top 0.61: C9.+ 6.86,36.32 9.21,33.97 9.21,28.26 14.29,23.18 69.85,23.18 73.34,19.68 82.97,19.68 K4.1
  Bottom 0.61: K4.1 81.53,18.48 72.22,27.79 R10.2
N$49  (via drill 0.4)
  Top 0.406: R64.2 84.56,45.51 v84.14,45.09
  Bottom 0.254: Q4.3 70.32,37.46
  Bottom 0.406: K4.2 84.17,45.05 v84.14,45.09
  Bottom 0.61: K4.2 73.67,40.48 Q4.3 | 70.32,37.46 D4.A
N$50
  Top 0.406: R61.2 13.44,40.87 K1.2
  Bottom 0.254: 25.56,37.3 D1.A
  Bottom 0.61: K1.2 22.38,40.48 D1.A | Q1.3 25.56,37.3
N$51
  Top 0.61: K1.1 7.27,12.7 C6.+
  Bottom 0.61: K1.1 13.05,23.21 17.63,27.79 R7.2
N$74  (1 unrouted)
  Bottom 0.254: K1.4 27.25,17.02
N$75  (1 unrouted)
  Bottom 0.254: K2.4 52.66,17.02
N$76  (1 unrouted)
  Bottom 0.254: K3.4 75.52,17.02
N$77  (1 unrouted)
  Bottom 0.254: K4.4 96,16.51
N$80  (via drill 0.4)
  Top 0.406: v110.81,22.23 107.31,18.73 v105.09,18.73
  Bottom 0.254: v110.81,22.23 110.49,22.23 110.06,22.66 U2.1 | R35.2 C20.1 | U2.9 106.07,22.25 105.09,21.27 C20.1 | C20.1
  Bottom 0.406: L1.1 113.03,22.86 112.39,22.23 v110.81,22.23 | C20.1 v105.09,18.73
RX
  Bottom 0.254: 106.47,46.57 UART.2 | 106.36,44.35 R48.1 106.47,42.76 108.58,40.64 108.58,33.97 107.57,32.96 U2.31
  Bottom 0.305: R48.1 106.47,46.57
SDA  (via drill 0.4)
  Top 0.305: 127.63,42.86 v127,43.5
  Top 0.406: 118.11,42.76 I2C.1
  Bottom 0.406: v127,43.5 127,45.09 127.63,45.72 JP4.1 127.63,48.26 126.36,49.53 119.38,49.53 118.11,48.26 I2C.1
SWCLK  (via drill 0.4)  (1 unrouted)
  Top 0.305: v113.03,31.43 114.62,29.84
  Bottom 0.254: U2.37 112.28,30.68 v113.03,31.43
SWDIO  (via drill 0.4)  (1 unrouted)
  Top 0.305: v112.71,37.47 112.71,34.29 114.62,32.38
  Bottom 0.254: U2.34 109.07,36.36 110.17,37.47 v112.71,37.47
TX
  Bottom 0.254: 103.72,46.77 UART.3 | U2.30 107.06,33.08 107.95,33.97 107.95,40.22 104.35,43.81 R49.1
  Bottom 0.305: R49.1 103.72,46.77

### Text on the board
tNames: + | + | + | + | G T R + | G C D | G C D | + C D G | AC V1.0 | + | + | + -
bNames: 1 2 4 | 1 2 4